# EAGLE design mubi-ESP32-30 (EAGLE 7.2.0)
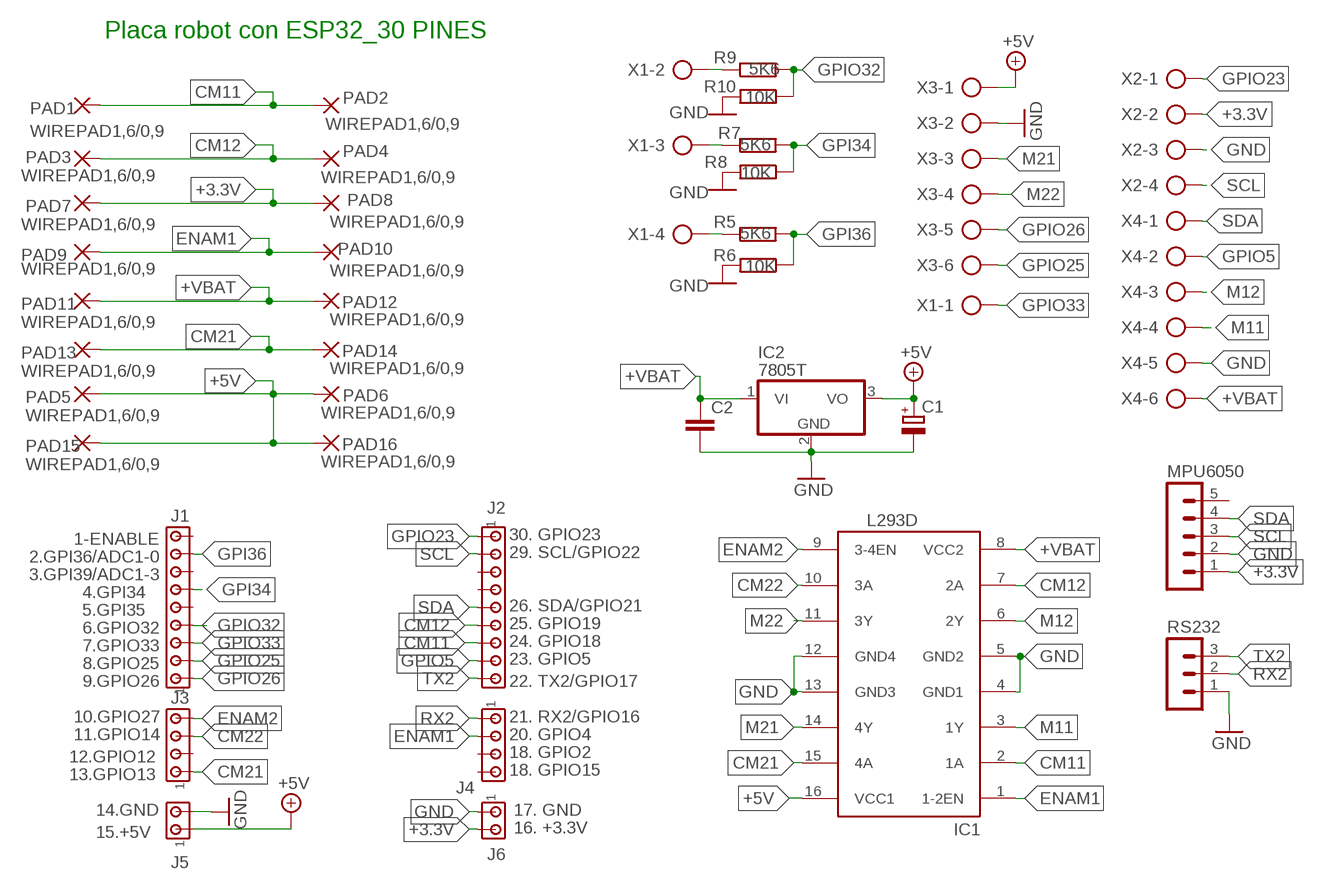
[diagram p0: schematic, sheet 1]

## Parts
C1  CPOL-EUE2.5-6  [E2,5-6]
C2  C-EU025-025X050  [C025-025X050]
IC1  L293D  [DIL16]
IC2  7805T  [TO220H]
J1  MTA09-100  [10X09MTA]
J2  MTA09-100  [10X09MTA]
J3  MTA04-100  [10X04MTA]
J4  MTA04-100  [10X04MTA]
J5  MTA02-100  [10X02MTA]
J6  MTA02-100  [10X02MTA]
MPU6050  MA05-1  [MA05-1]
PAD1  WIREPAD1,6/0,9  [1,6/0,9]
PAD2  WIREPAD1,6/0,9  [1,6/0,9]
PAD3  WIREPAD1,6/0,9  [1,6/0,9]
PAD4  WIREPAD1,6/0,9  [1,6/0,9]
PAD5  WIREPAD1,6/0,9  [1,6/0,9]
PAD6  WIREPAD1,6/0,9  [1,6/0,9]
PAD7  WIREPAD1,6/0,9  [1,6/0,9]
PAD8  WIREPAD1,6/0,9  [1,6/0,9]
PAD9  WIREPAD1,6/0,9  [1,6/0,9]
PAD10  WIREPAD1,6/0,9  [1,6/0,9]
PAD11  WIREPAD1,6/0,9  [1,6/0,9]
PAD12  WIREPAD1,6/0,9  [1,6/0,9]
PAD13  WIREPAD1,6/0,9  [1,6/0,9]
PAD14  WIREPAD1,6/0,9  [1,6/0,9]
PAD15  WIREPAD1,6/0,9  [1,6/0,9]
PAD16  WIREPAD1,6/0,9  [1,6/0,9]
R5  5K6  R-EU_0204/5  [0204/5]
R6  10K  R-EU_0204/5  [0204/5]
R7  5K6  R-EU_0204/5  [0204/5]
R8  10K  R-EU_0204/5  [0204/5]
R9  5K6  R-EU_0204/5  [0204/5]
R10  10K  R-EU_0204/5  [0204/5]
RS232  MA03-1  [MA03-1]
X1  AK500/4-H  [AK500/4-H]
X2  AK500/4-H  [AK500/4-H]
X3  AK500/6-H  [AK500/6-H]
X4  AK500/6-H  [AK500/6-H]

## Nets
+3.3V: J6.2 MPU6050.1 PAD7.1(P) PAD8.1(P) X2.2
+5V: C1.+ IC1.16(VCC1) IC2.3(VO) J5.1 PAD5.1(P) PAD6.1(P) PAD15.1(P) PAD16.1(P) X3.1
+VBAT: C2.1 IC1.8(VCC2) IC2.1(VI) PAD11.1(P) PAD12.1(P) X4.6
CM11: IC1.2(1A) J2.7 PAD1.1(P) PAD2.1(P)
CM12: IC1.7(2A) J2.6 PAD3.1(P) PAD4.1(P)
CM21: IC1.15(4A) J3.1 PAD13.1(P) PAD14.1(P)
CM22: IC1.10(3A) J3.3
ENAM1: IC1.1(1-2EN) J4.2 PAD9.1(P) PAD10.1(P)
ENAM2: IC1.9(3-4EN) J3.4
GND: C1.- C2.2 IC1.4(GND1) IC1.5(GND2) IC1.12(GND4) IC1.13(GND3) IC2.2(GND) J5.2 J6.1 MPU6050.2 R6.2 R8.2 R10.2 RS232.1 X2.3 X3.2 X4.5
GPI34: J1.6 R7.2 R8.1
GPI36: J1.8 R5.2 R6.1
GPIO5: J2.8 X4.2
GPIO23: J2.1 X2.1
GPIO25: J1.2 X3.6
GPIO26: J1.1 X3.5
GPIO32: J1.4 R9.2 R10.1
GPIO33: J1.3 X1.1
M11: IC1.3(1Y) X4.4
M12: IC1.6(2Y) X4.3
M21: IC1.14(4Y) X3.3
M22: IC1.11(3Y) X3.4
N$3: R5.1 X1.4
N$5: R7.1 X1.3
N$8: R9.1 X1.2
RX2: J4.1 RS232.2
SCL: J2.2 MPU6050.3 X2.4
SDA: J2.5 MPU6050.4 X4.1
TX2: J2.9 RS232.3
Unconnected: J1.5 J1.7 J1.9 J2.3 J2.4 J3.2 J4.3 J4.4 MPU6050.5

## Notes on the sheet
- Placa robot con ESP32_30 PINES
- 1-ENABLE | 30. GPIO23
- 2.GPI36/ADC1-0 | 29. SCL/GPIO22
- 3.GPI39/ADC1-3
- 4.GPI34
- 5.GPI35 | 26. SDA/GPIO21
- 6.GPIO32 | 25. GPIO19
- 7.GPIO33 | 24. GPIO18
- 8.GPIO25 | 23. GPIO5
- 9.GPIO26 | 22. TX2/GPIO17
- 10.GPIO27 | 21. RX2/GPIO16
- 11.GPIO14 | 20. GPIO4
- 12.GPIO12 | 18. GPIO2
- 13.GPIO13 | 18. GPIO15
- 14.GND | 17. GND
- 15.+5V | 16. +3.3V

## Library data of the parts
C1 = resistor:CPOL-EU: POLARIZED CAPACITOR, European symbol
C2 = rcl:C-EU: CAPACITOR, European symbol
IC1 = st-microelectronics:L293D: PUSH-PULL 4 CHANNEL DRIVER; MPN: L293D; OC_FARNELL: 9589619; OC_NEWARK: 56P8249
IC2 = linear:78*: Positive VOLTAGE REGULATOR Source: http://cache.national.com/ds/LM/LM78L05.pdf http://www.fairchildsemi.com/ds/LM/LM7805.pdf
J1 J2 = con-amp:MTA09-100: AMP connector
J3 J4 = con-amp:MTA04-100: AMP connector
J5 J6 = con-amp:MTA02-100: AMP connector
MPU6050 = con-lstb:MA05-1: PIN HEADER; OC_FARNELL: unknown; OC_NEWARK: unknown
PAD1-PAD16 = wirepad:WIREPAD: Wire PAD connect wire on PCB
R5-R10 = resistor:R-EU_: RESISTOR, European symbol
RS232 = con-lstb:MA03-1: PIN HEADER; OC_FARNELL: unknown; OC_NEWARK: unknown
X1 X2 = con-ptr500:AK500/4-H: CONNECTOR Aug. 2004 / PTR Meßtechnik: Die Bezeichnung der Serie AK505 wurde geändert. Es handelt sich hierbei um AK500 in horizontaler Ausführung.; OC_FARNELL: unknown; OC_NEWARK: unknown
X3 X4 = con-ptr500:AK500/6-H: CONNECTOR Aug. 2004 / PTR Meßtechnik: Die Bezeichnung der Serie AK505 wurde geändert. Es handelt sich hierbei um AK500 in horizontaler Ausführung.

## Board
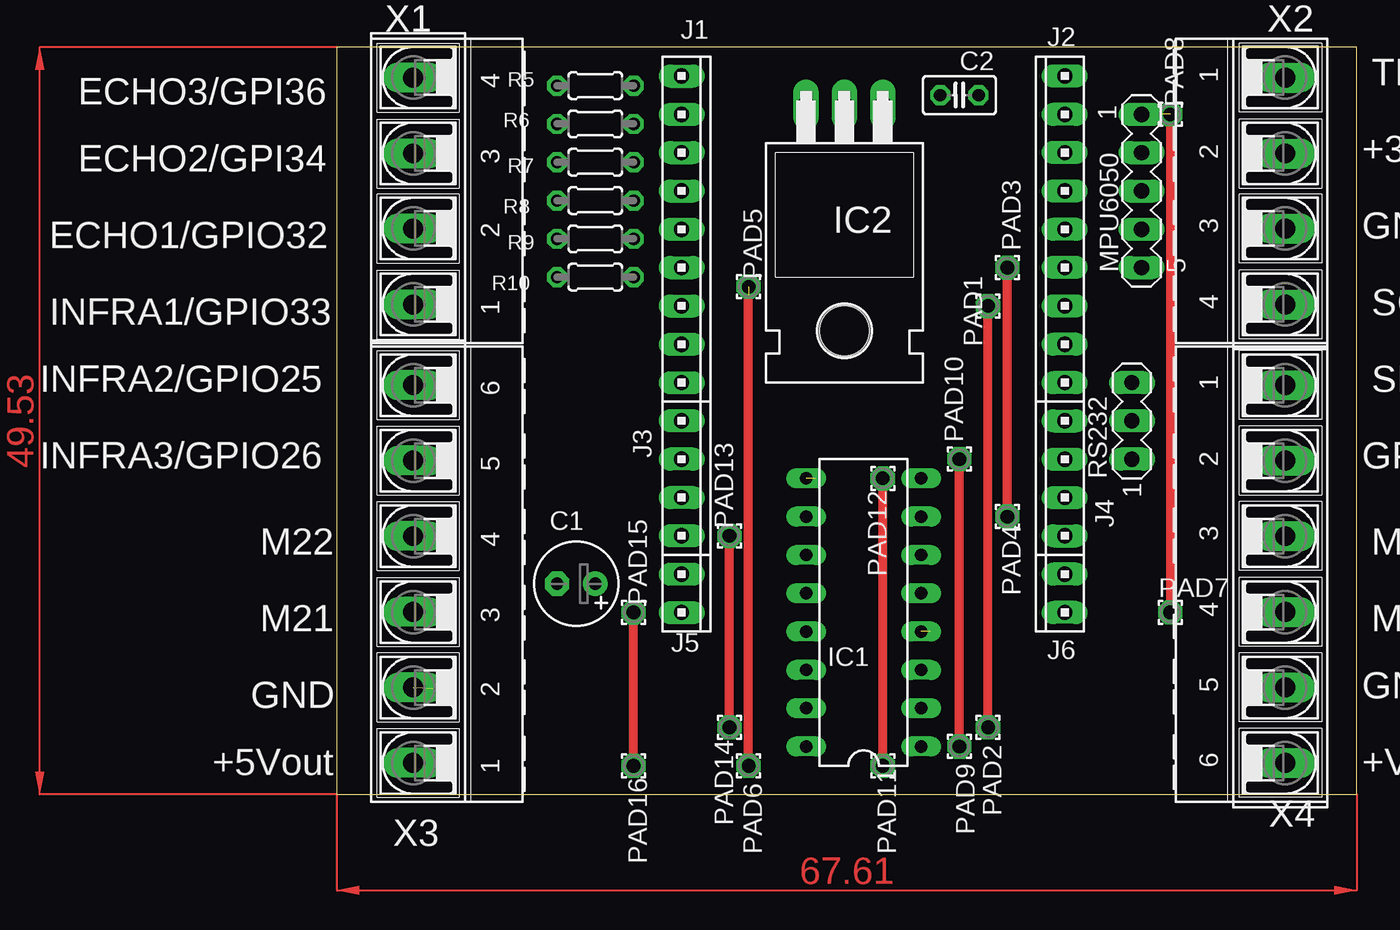
[diagram p1: board, top side]
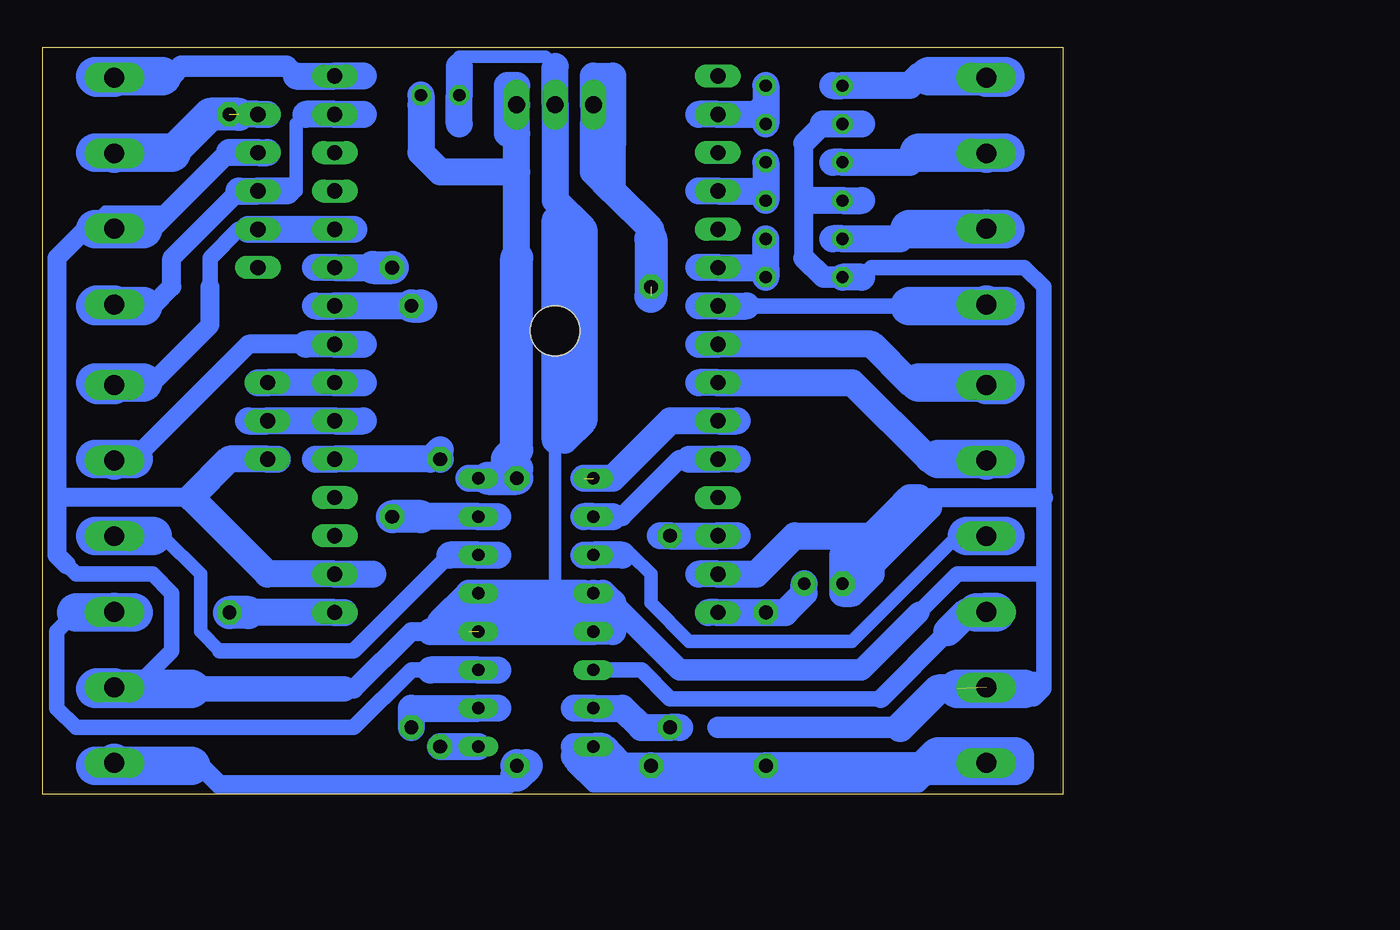
[diagram p2: board, bottom side, seen from below]

Size 67.61 x 49.52 mm. Coordinates in mm from the lower left corner, seen from the top.
Outline: 0,0 67.61,0 67.61,49.52 0,49.52 0,0
Copper layers (1*16): Top 0.035mm / dielectric 1.5mm / Bottom 0.035mm
Design rules "default": minimum track width 10mil, minimum drill 24mil, track to track 8mil, track to pad 8mil, pad to pad 8mil, via to via 8mil, smd to smd 8mil, copper to edge 40mil, drill to drill 8mil, minimum pad ring 10mil, minimum via ring 8mil, stop-mask expansion 4mil, vias tented up to drill 0mil, thermal gap 10mil

### Footprints (pad centres in the part's own frame; a part is rotated, then mirrored left to right if it is on the bottom)
E2,5-6 = drill 0.813 pad 1.6: + -1.27,0 | drill 0.813 pad 1.6 octagon: - 1.27,0
C025-025X050 = drill 0.813 octagon: 1 -1.27,0; 2 1.27,0
DIL16 = drill 0.813 long: 1 -8.89,-3.81; 2 -6.35,-3.81; 3 -3.81,-3.81; 4 -1.27,-3.81; 5 1.27,-3.81; 6 3.81,-3.81; 7 6.35,-3.81; 8 8.89,-3.81; 9 8.89,3.81; 10 6.35,3.81; 11 3.81,3.81; 12 1.27,3.81; 13 -1.27,3.81; 14 -3.81,3.81; 15 -6.35,3.81; 16 -8.89,3.81
TO220H = drill 1.118 long: 1 -2.54,-10.16; 2 0,-10.16; 3 2.54,-10.16 | hole 3.302: 0,4.826
10X09MTA = drill 1.016 long: 1 10.16,0; 2 7.62,0; 3 5.08,0; 4 2.54,0; 5 0,0; 6 -2.54,0; 7 -5.08,0; 8 -7.62,0; 9 -10.16,0
10X04MTA = drill 1.016 long: 1 3.81,0; 2 1.27,0; 3 -1.27,0; 4 -3.81,0
10X02MTA = drill 1.016 long: 1 1.27,0; 2 -1.27,0
MA05-1 = drill 1.016 long: 1 -5.08,0; 2 -2.54,0; 3 0,0; 4 2.54,0; 5 5.08,0
1,6/0,9 = drill 0.914 pad 1.6 octagon: 1 0,0
0204/5 = drill 0.813 octagon: 1 -2.54,0; 2 2.54,0
MA03-1 = drill 1.016 long: 1 -2.54,0; 2 0,0; 3 2.54,0
AK500/4-H = drill 1.321 long: 1 -7.518,0; 2 -2.489,0; 3 2.489,0; 4 7.518,0
AK500/6-H = drill 1.321 long: 1 -12.522,0; 2 -7.518,0; 3 -2.515,0; 4 2.515,0; 5 7.518,0; 6 12.522,0

### Placement (x,y rotation side)
C1  15.88,13.97 180 top
C2  41.27,46.35 180 top
IC1  34.92,12.06 90 top
IC2  33.66,35.56 180 top
J1  22.86,37.47 270 top
J2  48.26,37.47 90 top
J3  22.86,20.95 270 top
J4  48.26,20.95 90 top
J5  22.86,13.34 270 top
J6  48.26,13.34 90 top
MPU6050  53.34,40.01 270 top
PAD1  43.18,32.38 0 top
PAD2  43.18,4.45 0 top
PAD3  44.45,34.92 0 top
PAD4  44.45,18.41 0 top
PAD5  27.3,33.66 0 top
PAD6  27.3,1.91 0 top
PAD7  55.24,12.06 0 top
PAD8  55.24,45.09 0 top
PAD9  41.27,3.17 0 top
PAD10  41.27,22.23 0 top
PAD11  36.2,1.91 0 top
PAD12  36.2,20.95 0 top
PAD13  26.04,17.14 0 top
PAD14  26.04,4.45 0 top
PAD15  19.68,12.06 0 top
PAD16  19.68,1.91 0 top
R5  17.14,46.99 0 top
R6  17.14,44.45 180 top
R7  17.14,41.91 0 top
R8  17.14,39.37 180 top
R9  17.14,36.83 0 top
R10  17.14,34.29 180 top
RS232  52.7,24.77 90 top
X1  5.08,40.01 90 top
X2  62.87,40.01 270 top
X3  5.08,14.61 90 top
X4  62.87,14.61 270 top

### Tracks (layer width: path | path; a pad name or v marks a point on that pad's centre or on a via)
+3.3V  (1 unrouted)
  Top 0.61: PAD8.1 PAD7.1
  Bottom 1.778: 47.62,12.06 J6.2 53.98,12.06 | 52.7,45.09 MPU6050.1 54.61,45.09
  Bottom 2.184: 53.98,12.06 PAD7.1 | 54.61,45.09 56.52,45.09 59.05,42.55
  Bottom 2.54: 59.05,42.55 62.92,42.55 | 64.14,42.55 62.92,42.55 | 62.92,42.55 X2.2
+5V  (1 unrouted)
  Top 0.61: PAD6.1 PAD5.1 | PAD16.1 PAD15.1
  Bottom 1.016: 8.89,1.91 8.89,1.27 9.53,0.64 31.11,0.64 32.38,1.91 10.16,1.91 9.53,1.27 8.89,1.91
  Bottom 1.778: 31.11,44.45 IC2.3 31.11,47.62 29.84,47.62 29.84,43.18 | 29.84,40.01 31.11,41.27 31.11,44.45 | 29.84,40.01 27.3,37.47 27.3,36.83 | 32.38,3.17 IC1.16 30.48,3.17 29.84,2.54 | 29.21,1.91 31.75,1.91 32.38,2.54 29.84,2.54 | 29.84,2.54 29.21,1.91 | 29.21,1.91 PAD6.1 PAD16.1 8.89,1.91 | 23.5,12.06 J5.1 PAD15.1 18.41,12.06 17.14,13.34 C1.+ | 29.84,40.01 29.84,43.18 | 29.84,43.18 31.11,44.45
  Bottom 2.184: 27.3,36.83 27.3,33.02
  Bottom 2.54: 5.26,1.91 3.17,1.91 3.17,2.54 8.26,2.54 8.89,1.91 5.26,1.91 | 5.26,1.91 X3.1
+VBAT
  Top 0.61: PAD11.1 PAD12.1
  Bottom 1.27: 36.2,1.27 36.83,0.64 55.88,0.64 57.15,1.91 57.78,1.91
  Bottom 1.778: 39.37,20.95 IC1.8 38.1,20.95 | 36.2,35.56 36.2,41.27 | 36.2,41.27 IC2.1 | IC2.1 36.2,46.99 36.83,46.99 36.83,43.81 36.2,43.81 IC2.1 | 42.55,45.72 C2.1 42.55,42.55 41.27,41.27 36.2,41.27
  Bottom 2.184: PAD11.1 35.56,1.91 36.2,1.27 | 38.1,20.95 PAD12.1 36.2,21.59 36.83,22.23 36.2,22.86 36.2,35.56
  Bottom 2.54: 57.78,1.91 63.04,1.91 | 64.14,1.91 63.04,1.91 | 63.04,1.91 X4.6
CM11
  Top 0.61: PAD2.1 PAD1.1
  Bottom 1.778: PAD2.1 43.18,5.71 IC1.2 37.47,5.71 | 42.55,32.38 J2.7 49.53,32.38
  Bottom 2.184: PAD1.1 42.55,32.38
CM12
  Top 0.61: PAD4.1 PAD3.1
  Bottom 1.778: 37.47,18.41 IC1.7 42.55,18.41 | 49.53,34.92 J2.6 45.72,34.92
  Bottom 2.184: 42.55,18.41 PAD4.1 | 45.72,34.92 PAD3.1
CM21
  Top 0.61: PAD14.1 PAD13.1
  Bottom 1.778: 32.38,5.71 IC1.15 29.21,5.71 27.94,4.45 PAD14.1 25.4,4.45 | 26.67,17.14 PAD13.1 J3.1 21.59,17.14
CM22
  Bottom 1.27: 29.84,18.41 29.21,18.41 25.4,22.23 24.77,22.23
  Bottom 1.778: 31.75,18.41 IC1.10 29.84,18.41 | 24.77,22.23 J3.3 21.59,22.23
ENAM1
  Top 0.61: PAD9.1 PAD10.1
  Bottom 1.778: PAD9.1 IC1.1 | PAD10.1 41.27,22.86 41.91,22.23 J4.2 49.53,22.23
ENAM2  (1 unrouted)
  Bottom 1.778: 21.59,24.77 J3.4 26.04,24.77 29.84,20.95 31.75,20.95
GND  (2 unrouted)
  Bottom 0.61: 52.7,42.55 55.88,42.55 59.69,38.73 63.5,38.73 64.77,37.47
  Bottom 0.813: 33.02,24.77 33.02,23.5 33.66,22.86 33.66,13.34 | 33.66,48.26 34.29,48.9 40.01,48.9 40.01,48.26
  Bottom 1.016: 1.91,7.62 2.22,7.3 | 2.22,7.3 2.54,6.99 | 13.34,34.29 12.7,34.92 2.54,34.92 1.27,33.66 1.27,19.68 1.27,14.61 | 1.27,14.61 1.27,6.99 1.91,6.35 1.91,6.99 2.22,7.3 | 9.53,12.06 6.99,14.61 1.27,14.61 | 66.04,15.24 65.41,14.61 60.33,14.61 59.05,13.34 59.05,9.53 61.59,6.99
  Bottom 1.27: 47.62,6.99 46.99,6.99 43.18,10.79 41.91,10.79 | 17.14,35.56 17.14,39.37 | 17.14,39.37 17.14,43.18 | 9.53,19.68 1.27,19.68 | 16.51,39.37 17.14,39.37 | 57.78,19.68 66.67,19.68 | 66.04,15.24 66.67,15.88 66.67,19.68 | 55.24,42.55 60.33,37.47 60.96,37.47 | 64.77,37.47 66.67,35.56 66.67,19.68
  Bottom 1.422: 10.79,4.45 22.86,4.45 | R10.2 15.88,34.29 17.14,35.56 | 17.14,43.18 15.88,44.45 | 29.84,12.7 25.4,8.26 13.34,8.26 9.53,12.06
  Bottom 1.676: 57.78,6.99 47.62,6.99
  Bottom 1.778: 24.13,14.61 J5.2 20.32,14.61 17.78,17.14 12.7,17.14 10.48,19.37 | C1.- 14.61,13.34 13.97,13.34 12.7,14.61 12.7,15.88 14.61,15.88 C1.- | 41.91,10.79 39.37,10.79 | 39.37,10.79 IC1.13 29.84,10.79 29.84,12.7 30.48,13.34 IC1.12 | IC1.5 39.37,13.34 41.27,11.43 31.11,11.43 30.48,12.06 31.75,13.34 33.66,13.34 IC1.5 | IC1.5 40.01,12.06 38.1,12.06 | 31.75,12.06 38.1,12.06 | 38.1,12.06 39.37,10.79 | 13.34,44.45 R6.2 15.88,44.45 | 13.34,34.29 R10.2 | 13.34,39.37 R8.2 16.51,39.37 | 10.48,19.37 10.16,19.68 9.53,19.68 | C1.- 13.97,13.97 8.89,19.05 10.16,19.05 10.48,19.37 | 45.72,14.61 J6.1 52.7,14.61 57.78,19.68 55.24,22.23 RS232.1 52.07,22.23 | 33.02,37.47 31.75,37.47 | 31.75,37.47 31.75,24.77 33.02,23.5 33.66,23.5 33.66,38.1 | 33.02,37.47 33.66,38.1 | 33.66,38.1 33.02,38.1 33.02,37.47 | 33.02,37.47 33.02,24.77 | 52.7,42.55 MPU6050.2 55.24,42.55 | 33.66,48.26 IC2.2 33.66,39.37 31.75,37.47 | 40.01,48.26 C2.2 40.01,44.45
  Bottom 1.93: 6.99,6.99 8.26,6.99 10.79,4.45
  Bottom 2.54: 2.54,6.99 6.99,6.99 | X4.5 64.03,7.09 64.14,6.99 61.59,6.99 57.78,6.99 | 60.96,37.47 62.92,37.47 | 64.14,37.47 62.92,37.47 | 62.92,37.47 X2.3
GPI34
  Bottom 1.778: R7.2 19.68,40.01 | 19.68,40.01 R8.1 | 24.13,40.01 J1.6 19.68,40.01
GPI36
  Bottom 1.778: R5.2 19.68,45.72 | 19.68,45.72 R6.1 | 24.13,45.09 J1.8 20.32,45.09 19.68,45.72
GPIO5
  Bottom 1.27: 50.16,29.84 53.98,29.84 61.59,22.23
  Bottom 1.778: 46.35,29.84 J2.8 50.16,29.84
  Bottom 2.54: 61.59,22.23 62.97,22.23 | 64.14,22.23 62.97,22.23 | 62.97,22.23 X4.2
GPIO23
  Bottom 1.422: 59.69,47.62 59.05,47.62 58.42,48.26 51.44,48.26 50.8,47.62
  Bottom 1.778: 50.8,47.62 J2.1 46.35,47.62
  Bottom 2.54: X2.1 64.03,47.52 64.14,47.62 59.69,47.62
GPIO25
  Bottom 1.778: 9.53,27.3 10.16,27.3 12.7,29.84 J1.2 24.13,29.84
  Bottom 2.54: X3.6 3.99,27.13 3.81,27.3 9.53,27.3
GPIO26
  Bottom 1.778: 24.13,27.3 J1.1 13.97,27.3 8.89,22.23 8.26,22.23
  Bottom 2.54: 8.26,22.23 4.98,22.23 | 3.81,22.23 4.98,22.23 | 4.98,22.23 X3.5
GPIO32
  Bottom 1.778: 24.13,34.92 J1.4 19.68,34.92 R10.1 R9.2
GPIO33
  Bottom 1.016: 20.95,32.38 10.16,32.38
  Bottom 1.778: 24.13,32.38 J1.3 20.95,32.38
  Bottom 2.54: 10.16,32.38 4.98,32.38 | 3.81,32.38 4.98,32.38 | 4.98,32.38 X1.1
M11
  Bottom 1.016: 41.91,8.26 43.18,8.26 46.99,4.45 65.41,4.45 66.67,5.71 66.67,10.79 65.41,12.06
  Bottom 1.778: 37.47,8.26 IC1.3 41.91,8.26
  Bottom 2.54: 65.41,12.06 62.84,12.06 | 61.59,12.06 62.84,12.06 | 62.84,12.06 X4.4
M12
  Bottom 0.889: 55.88,9.53 57.15,10.79 57.15,14.61 59.69,17.14
  Bottom 1.016: 40.64,15.88 46.99,9.53 55.88,9.53 | 59.69,17.14 60.33,17.14
  Bottom 1.778: 37.47,15.88 IC1.6 40.64,15.88
  Bottom 2.54: 60.33,17.14 62.89,17.14 | 64.14,17.14 62.89,17.14 | 62.89,17.14 X4.3
M21
  Bottom 1.016: 12.06,6.35 26.04,6.35 27.94,8.26 IC1.14
  Bottom 1.27: 7.62,10.79 12.06,6.35
  Bottom 1.93: 5.71,12.06 6.35,12.06 7.62,10.79
  Bottom 2.54: X3.3 4.47,12.09 4.45,12.06 5.71,12.06
M22
  Bottom 0.889: 6.35,17.14 6.99,17.14 13.97,10.16 24.77,10.16 27.3,12.7 27.3,14.61 28.57,15.88 29.21,15.88
  Bottom 1.778: 29.21,15.88 IC1.11 31.75,15.88
  Bottom 2.54: X3.4 3.83,17.12 3.81,17.14 6.35,17.14
N$3
  Bottom 1.778: 8.89,47.62 9.53,47.62 10.16,46.99 R5.1 15.24,46.99
  Bottom 2.54: X1.4 3.91,47.52 3.81,47.62 8.89,47.62
N$5
  Bottom 1.778: 15.24,41.91 R7.1 10.16,41.91 9.53,42.55
  Bottom 2.54: 9.53,42.55 5.03,42.55 | 3.81,42.55 5.03,42.55 | 5.03,42.55 X1.3
N$8
  Bottom 1.778: 15.24,36.83 R9.1 10.79,36.83 10.16,37.47
  Bottom 2.54: 10.16,37.47 5.03,37.47 | 3.81,37.47 5.03,37.47 | 5.03,37.47 X1.2
RX2
  Bottom 1.778: 46.35,24.77 J4.1 RS232.2 53.98,24.77
SCL
  Bottom 0.889: 50.16,45.09 50.8,44.45 50.8,40.01 51.44,40.01
  Bottom 1.27: 60.96,32.38 60.33,32.38 59.05,33.66 59.05,35.56 54.61,40.01
  Bottom 1.778: 46.35,45.09 J2.2 50.16,45.09 | 51.44,40.01 MPU6050.3 54.61,40.01
  Bottom 2.54: X2.4 64.03,32.49 64.14,32.38 60.96,32.38
SDA
  Bottom 1.016: 56.52,33.66 56.52,35.56 54.61,37.47 53.98,37.47
  Bottom 1.27: 60.96,27.3 60.33,27.3 56.52,31.11 56.52,33.66
  Bottom 1.778: 46.99,37.47 J2.5 MPU6050.4 53.98,37.47
  Bottom 2.54: X4.1 63.96,27.13 64.14,27.3 60.96,27.3
TX2
  Bottom 1.778: 46.35,27.3 J2.9 RS232.3 53.34,27.3
(copper drawn outside any net)
  shapes: Top area x2

### Text on the board
tNames: TRIG/GPIO23 | ECHO3/GPI36 | +3.3VOUT | ECHO2/GPI34 | GND | ECHO1/GPIO32 | SCL/GPIO22 | INFRA1/GPIO33 | INFRA2/GPIO25 | SDA/GPIO21 | INFRA3/GPIO26 | GPIO5 | M22 | M12 | M21 | M11 | GND | GND | +5Vout | +VBAT